# Altium schematic sheet spi_flash.SchDoc
size A4
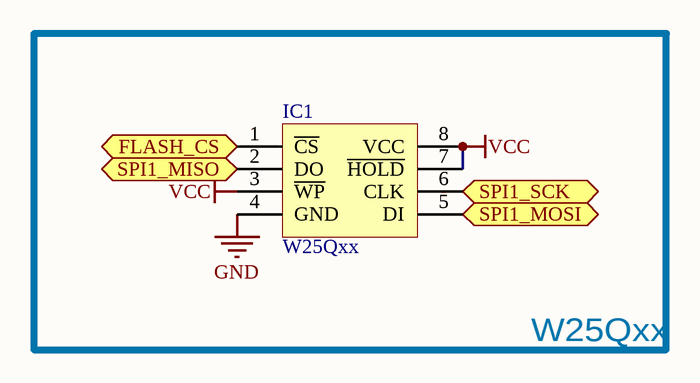
[diagram p0: spi_flash.SchDoc]

## Parts
IC1  W25Qxx  [SOP8W_N]

## Blocks framed on the sheet
W25Qxx: IC1

## Ports
FLASH_CS (bidir), SPI1_MISO (bidir), SPI1_MOSI (bidir), SPI1_SCK (bidir)

## Nets
GND: IC1.4(GND)
VCC: IC1.3(~{WP}) IC1.7(~{HOLD}) IC1.8(VCC)
FLASH_CS: IC1.1(~{CS}) ; port FLASH_CS
SPI1_MISO: IC1.2(DO) ; port SPI1_MISO
SPI1_MOSI: IC1.5(DI) ; port SPI1_MOSI
SPI1_SCK: IC1.6(CLK) ; port SPI1_SCK

## Library data of the parts
IC1 = W25Qxx: 外置Flash; 版权归属: 源创客; BOM名称: 外置Flash; 学习资源: www.ooocke.com